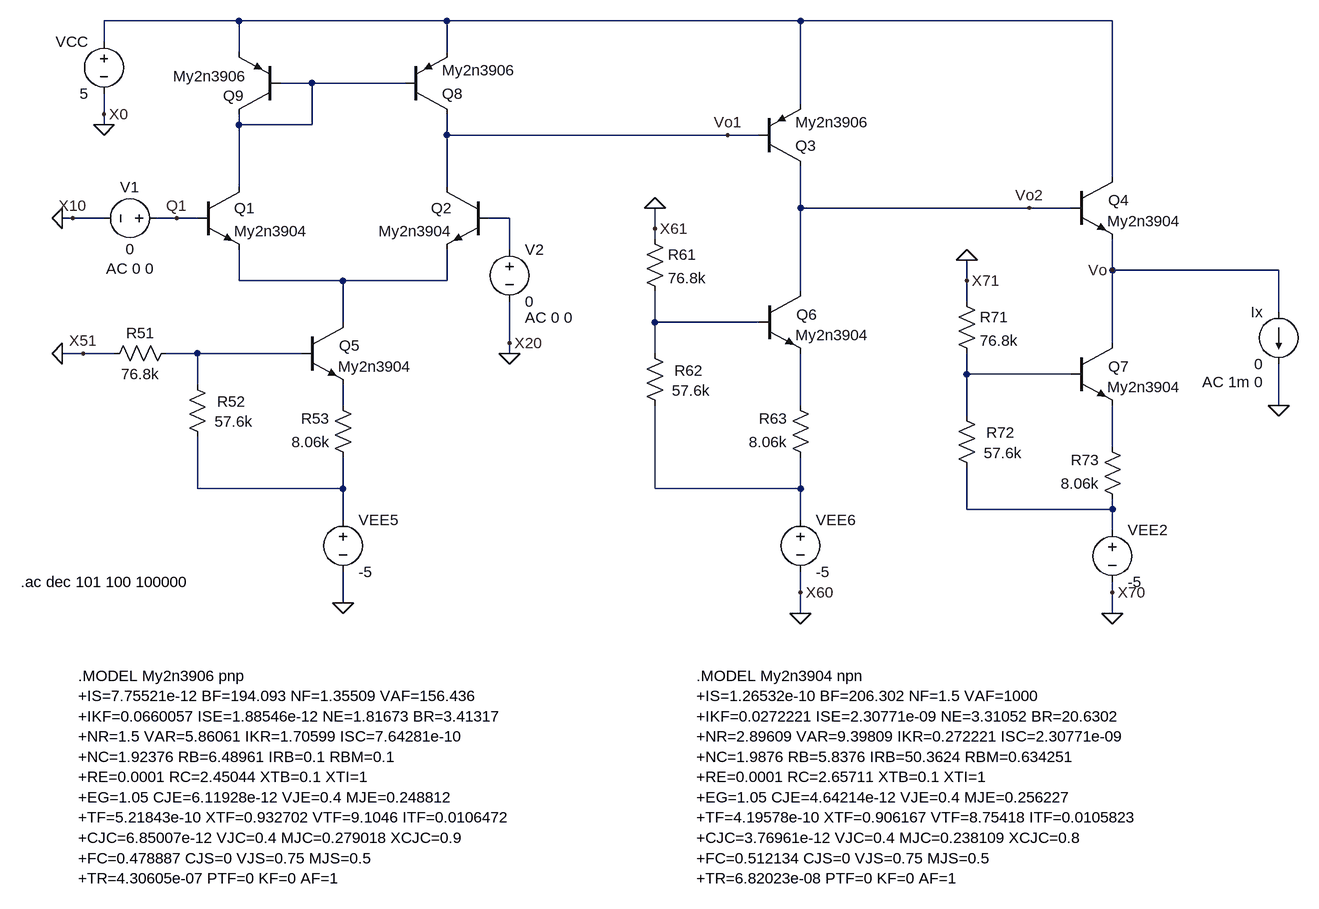
[diagram p0: schematic project4_p1a.asc]
project4_p1a.asc, the LTspice schematic file:
Version 4
SHEET 1 3060 1032
WIRE 128 -320 -80 -320
WIRE 448 -320 128 -320
WIRE 992 -320 448 -320
WIRE 1472 -320 992 -320
WIRE -80 -288 -80 -320
WIRE 128 -272 128 -320
WIRE 448 -272 448 -320
WIRE 240 -224 192 -224
WIRE 384 -224 240 -224
WIRE 992 -192 992 -320
WIRE -80 -176 -80 -208
WIRE -80 -160 -80 -176
WIRE 128 -160 128 -176
WIRE 240 -160 240 -224
WIRE 240 -160 128 -160
WIRE 448 -144 448 -176
WIRE 880 -144 448 -144
WIRE 928 -144 880 -144
WIRE 1472 -80 1472 -320
WIRE 128 -64 128 -160
WIRE 448 -64 448 -144
WIRE 992 -32 992 -96
WIRE 1344 -32 992 -32
WIRE 1408 -32 1344 -32
WIRE -128 -16 -144 -16
WIRE -80 -16 -128 -16
WIRE 32 -16 0 -16
WIRE 64 -16 32 -16
WIRE 544 -16 512 -16
WIRE 768 0 768 -32
WIRE 768 16 768 0
WIRE 544 32 544 -16
WIRE 1472 64 1472 16
WIRE 1728 64 1472 64
WIRE 128 80 128 32
WIRE 288 80 128 80
WIRE 448 80 448 32
WIRE 448 80 288 80
WIRE 1248 80 1248 48
WIRE 992 96 992 -32
WIRE 1248 112 1248 80
WIRE 1728 128 1728 64
WIRE 288 144 288 80
WIRE 768 144 768 96
WIRE 928 144 768 144
WIRE 544 176 544 112
WIRE 1472 176 1472 64
WIRE -112 192 -144 192
WIRE -64 192 -112 192
WIRE 64 192 16 192
WIRE 224 192 64 192
WIRE 544 192 544 176
WIRE 768 192 768 144
WIRE 1248 224 1248 192
WIRE 1408 224 1248 224
WIRE 64 240 64 192
WIRE 288 272 288 240
WIRE 992 272 992 192
WIRE 1728 272 1728 208
WIRE 1248 288 1248 224
WIRE 1472 336 1472 272
WIRE 64 400 64 320
WIRE 288 400 288 352
WIRE 288 400 64 400
WIRE 768 400 768 272
WIRE 992 400 992 352
WIRE 992 400 768 400
WIRE 1248 432 1248 368
WIRE 1472 432 1472 416
WIRE 1472 432 1248 432
WIRE 288 448 288 400
WIRE 992 448 992 400
WIRE 1472 464 1472 432
WIRE 992 560 992 528
WIRE 1472 560 1472 544
WIRE 288 576 288 528
WIRE 992 592 992 560
WIRE 1472 592 1472 560
FLAG -144 192 0
FLAG -80 -160 0
FLAG 288 576 0
FLAG 544 192 0
FLAG 768 -32 0
FLAG 992 592 0
FLAG 1248 48 0
FLAG 1472 592 0
FLAG 1248 80 X71
FLAG -112 192 X51
FLAG 544 176 X20
FLAG -144 -16 0
FLAG -128 -16 X10
FLAG -80 -176 X0
FLAG 768 0 X61
FLAG 992 560 X60
FLAG 1472 560 X70
FLAG 1728 272 0
FLAG 880 -144 Vo1
FLAG 1344 -32 Vo2
FLAG 1472 64 Vo
FLAG 32 -16 Q1
SYMBOL npn 224 144 R0
WINDOW 0 58 36 Left 2
SYMATTR InstName Q5
SYMATTR Value My2n3904
SYMBOL voltage 288 432 R0
WINDOW 123 0 0 Left 0
WINDOW 39 0 0 Left 0
SYMATTR InstName VEE5
SYMATTR Value -5
SYMBOL voltage -80 -304 M0
WINDOW 123 0 0 Left 0
WINDOW 39 0 0 Left 0
SYMATTR InstName VCC
SYMATTR Value 5
SYMBOL res 304 368 R180
WINDOW 0 36 76 Left 2
WINDOW 3 36 40 Left 2
SYMATTR InstName R53
SYMATTR Value 8.06k
SYMBOL res 48 224 R0
WINDOW 0 46 42 Left 2
WINDOW 3 42 73 Left 2
SYMATTR InstName R52
SYMATTR Value 57.6k
SYMBOL res -80 208 R270
WINDOW 0 32 56 VTop 2
WINDOW 3 0 56 VBottom 2
SYMATTR InstName R51
SYMATTR Value 76.8k
SYMBOL npn 64 -64 R0
SYMATTR InstName Q1
SYMATTR Value My2n3904
SYMBOL npn 512 -64 M0
SYMATTR InstName Q2
SYMATTR Value My2n3904
SYMBOL pnp 192 -176 R180
WINDOW 0 56 29 Left 2
WINDOW 3 52 59 Left 2
SYMATTR InstName Q9
SYMATTR Value My2n3906
SYMBOL pnp 384 -176 M180
SYMATTR InstName Q8
SYMATTR Value My2n3906
SYMBOL voltage 544 16 R0
WINDOW 123 24 121 Left 2
WINDOW 39 0 0 Left 0
SYMATTR Value2 AC 0 0
SYMATTR InstName V2
SYMATTR Value 0
SYMBOL npn 928 96 R0
WINDOW 0 58 36 Left 2
SYMATTR InstName Q6
SYMATTR Value My2n3904
SYMBOL voltage 992 432 R0
WINDOW 123 0 0 Left 0
WINDOW 39 0 0 Left 0
SYMATTR InstName VEE6
SYMATTR Value -5
SYMBOL res 1008 368 R180
WINDOW 0 36 76 Left 2
WINDOW 3 36 40 Left 2
SYMATTR InstName R63
SYMATTR Value 8.06k
SYMBOL res 752 176 R0
WINDOW 0 46 42 Left 2
WINDOW 3 42 73 Left 2
SYMATTR InstName R62
SYMATTR Value 57.6k
SYMBOL res 752 0 R0
SYMATTR InstName R61
SYMATTR Value 76.8k
SYMBOL npn 1408 176 R0
WINDOW 0 58 36 Left 2
SYMATTR InstName Q7
SYMATTR Value My2n3904
SYMBOL voltage 1472 448 R0
WINDOW 123 0 0 Left 0
WINDOW 39 0 0 Left 0
SYMATTR InstName VEE2
SYMATTR Value -5
SYMBOL res 1488 432 R180
WINDOW 0 36 76 Left 2
WINDOW 3 36 40 Left 2
SYMATTR InstName R73
SYMATTR Value 8.06k
SYMBOL res 1232 272 R0
WINDOW 0 46 42 Left 2
WINDOW 3 42 73 Left 2
SYMATTR InstName R72
SYMATTR Value 57.6k
SYMBOL res 1232 96 R0
SYMATTR InstName R71
SYMATTR Value 76.8k
SYMBOL pnp 928 -96 M180
SYMATTR InstName Q3
SYMATTR Value My2n3906
SYMBOL npn 1408 -80 R0
WINDOW 0 58 36 Left 2
SYMATTR InstName Q4
SYMATTR Value My2n3904
SYMBOL voltage 16 -16 R90
WINDOW 0 -32 56 VBottom 2
WINDOW 3 32 56 VTop 2
WINDOW 123 93 56 VBottom 2
WINDOW 39 0 0 Left 0
SYMATTR InstName V1
SYMATTR Value 0
SYMATTR Value2 AC 0 0
SYMBOL current 1728 128 M0
WINDOW 123 24 108 Left 2
WINDOW 39 0 0 Left 0
SYMATTR Value2 AC 1m 0
SYMATTR InstName Ix
SYMATTR Value 0
TEXT 832 688 Left 2 !.MODEL My2n3904 npn\n+IS=1.26532e-10 BF=206.302 NF=1.5 VAF=1000\n+IKF=0.0272221 ISE=2.30771e-09 NE=3.31052 BR=20.6302\n+NR=2.89609 VAR=9.39809 IKR=0.272221 ISC=2.30771e-09\n+NC=1.9876 RB=5.8376 IRB=50.3624 RBM=0.634251\n+RE=0.0001 RC=2.65711 XTB=0.1 XTI=1\n+EG=1.05 CJE=4.64214e-12 VJE=0.4 MJE=0.256227\n+TF=4.19578e-10 XTF=0.906167 VTF=8.75418 ITF=0.0105823\n+CJC=3.76961e-12 VJC=0.4 MJC=0.238109 XCJC=0.8\n+FC=0.512134 CJS=0 VJS=0.75 MJS=0.5\n+TR=6.82023e-08 PTF=0 KF=0 AF=1
TEXT -120 688 Left 2 !.MODEL My2n3906 pnp\n+IS=7.75521e-12 BF=194.093 NF=1.35509 VAF=156.436\n+IKF=0.0660057 ISE=1.88546e-12 NE=1.81673 BR=3.41317\n+NR=1.5 VAR=5.86061 IKR=1.70599 ISC=7.64281e-10\n+NC=1.92376 RB=6.48961 IRB=0.1 RBM=0.1\n+RE=0.0001 RC=2.45044 XTB=0.1 XTI=1\n+EG=1.05 CJE=6.11928e-12 VJE=0.4 MJE=0.248812\n+TF=5.21843e-10 XTF=0.932702 VTF=9.1046 ITF=0.0106472\n+CJC=6.85007e-12 VJC=0.4 MJC=0.279018 XCJC=0.9\n+FC=0.478887 CJS=0 VJS=0.75 MJS=0.5\n+TR=4.30605e-07 PTF=0 KF=0 AF=1
TEXT -208 544 Left 2 !.ac dec 101 100 100000

The netlist it stands for:
* project4_p1a.asc
Q5 N004 N006 N008 0 My2n3904
VEE5 N011 0 -5
VCC N001 0 5
R53 N011 N008 8.06k
R52 N006 N011 57.6k
R51 0 N006 76.8k
Q1 N002 Q1 N004 0 My2n3904
Q2 Vo1 N003 N004 0 My2n3904
Q9 N002 N002 N001 0 My2n3906
Q8 Vo1 N002 N001 0 My2n3906
V2 N003 0 0 AC 0 0
Q6 Vo2 N005 N009 0 My2n3904
VEE6 N012 0 -5
R63 N012 N009 8.06k
R62 N005 N012 57.6k
R61 0 N005 76.8k
Q7 Vo N007 N010 0 My2n3904
VEE2 N013 0 -5
R73 N013 N010 8.06k
R72 N007 N013 57.6k
R71 0 N007 76.8k
Q3 Vo2 Vo1 N001 0 My2n3906
Q4 N001 Vo2 Vo 0 My2n3904
V1 Q1 0 0 AC 0 0
Ix Vo 0 0 AC 1m 0
.model NPN NPN
.model PNP PNP
.lib standard.bjt
.MODEL My2n3904 npn
+IS=1.26532e-10 BF=206.302 NF=1.5 VAF=1000
+IKF=0.0272221 ISE=2.30771e-09 NE=3.31052 BR=20.6302
+NR=2.89609 VAR=9.39809 IKR=0.272221 ISC=2.30771e-09
+NC=1.9876 RB=5.8376 IRB=50.3624 RBM=0.634251
+RE=0.0001 RC=2.65711 XTB=0.1 XTI=1
+EG=1.05 CJE=4.64214e-12 VJE=0.4 MJE=0.256227
+TF=4.19578e-10 XTF=0.906167 VTF=8.75418 ITF=0.0105823
+CJC=3.76961e-12 VJC=0.4 MJC=0.238109 XCJC=0.8
+FC=0.512134 CJS=0 VJS=0.75 MJS=0.5
+TR=6.82023e-08 PTF=0 KF=0 AF=1
.MODEL My2n3906 pnp
+IS=7.75521e-12 BF=194.093 NF=1.35509 VAF=156.436
+IKF=0.0660057 ISE=1.88546e-12 NE=1.81673 BR=3.41317
+NR=1.5 VAR=5.86061 IKR=1.70599 ISC=7.64281e-10
+NC=1.92376 RB=6.48961 IRB=0.1 RBM=0.1
+RE=0.0001 RC=2.45044 XTB=0.1 XTI=1
+EG=1.05 CJE=6.11928e-12 VJE=0.4 MJE=0.248812
+TF=5.21843e-10 XTF=0.932702 VTF=9.1046 ITF=0.0106472
+CJC=6.85007e-12 VJC=0.4 MJC=0.279018 XCJC=0.9
+FC=0.478887 CJS=0 VJS=0.75 MJS=0.5
+TR=4.30605e-07 PTF=0 KF=0 AF=1
.ac dec 101 100 100000
.backanno
.end